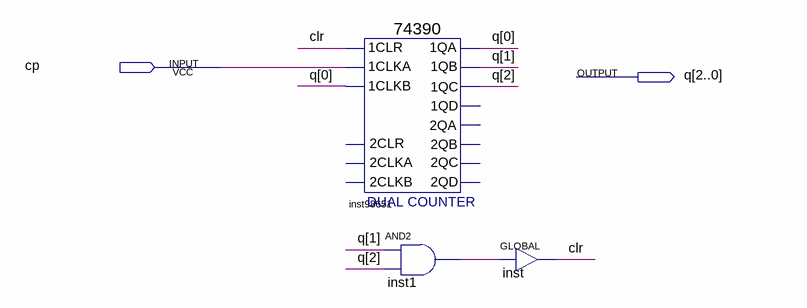
[diagram p0: schematic sheet]
// Quartus schematic counter6.bdf as structural Verilog: 3 symbols, 2 pins
module counter6 (
  input  cp,
  output [2:0] q
);

  wire clr, inst1_out;

  \74390  inst98651 (
    .\1CLR (clr), .\1CLKA (cp), .\1CLKB (q[0]), .\1QA (q[0]), .\1QB (q[1]), .\1QC (q[2]));  // open: 2CLKA, 2CLR, 2CLKB, 1QD, 2QA, 2QB, 2QC, 2QD
  and inst1 (inst1_out, q[1], q[2]);
  GLOBAL inst (.IN(inst1_out), .OUT(clr));
endmodule
